# EAGLE board NGDash (EAGLE 9.2.1), part 1 of 2
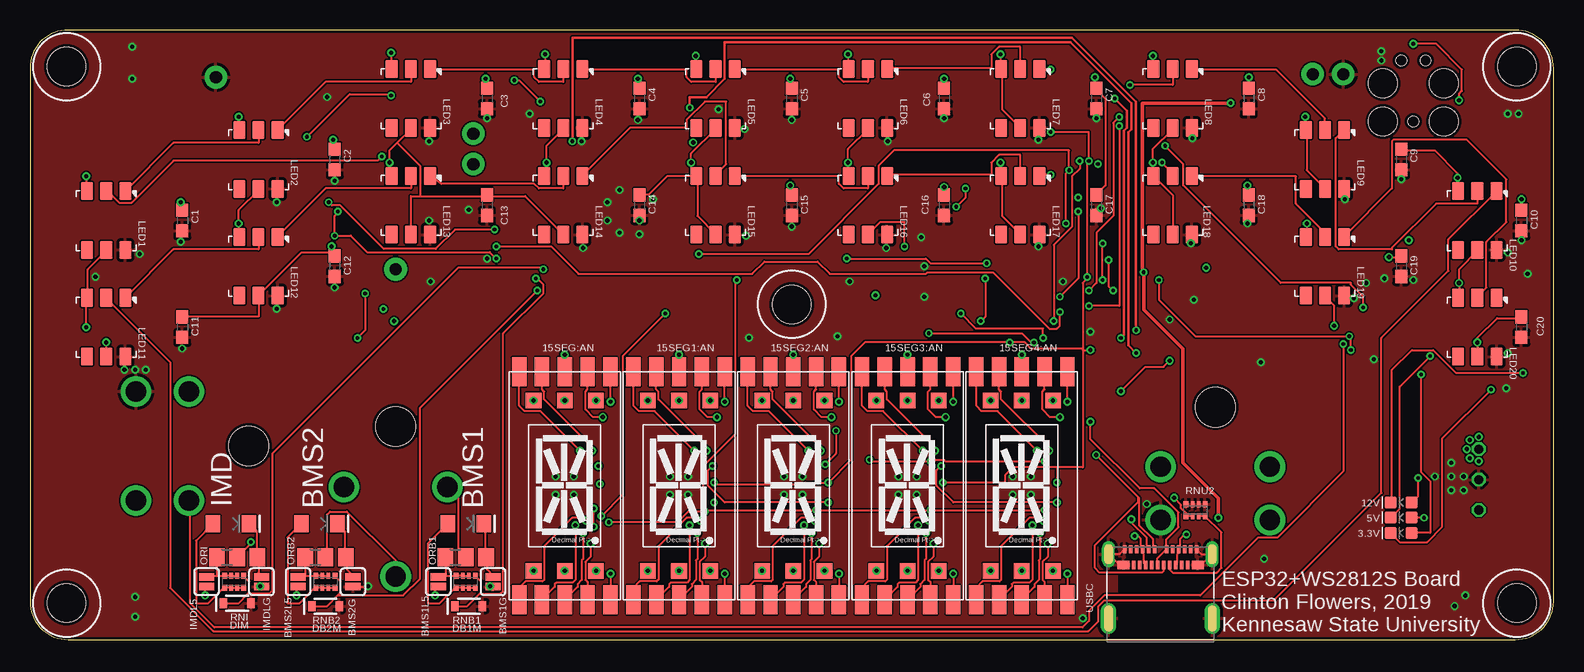
[diagram p5: board, top side]
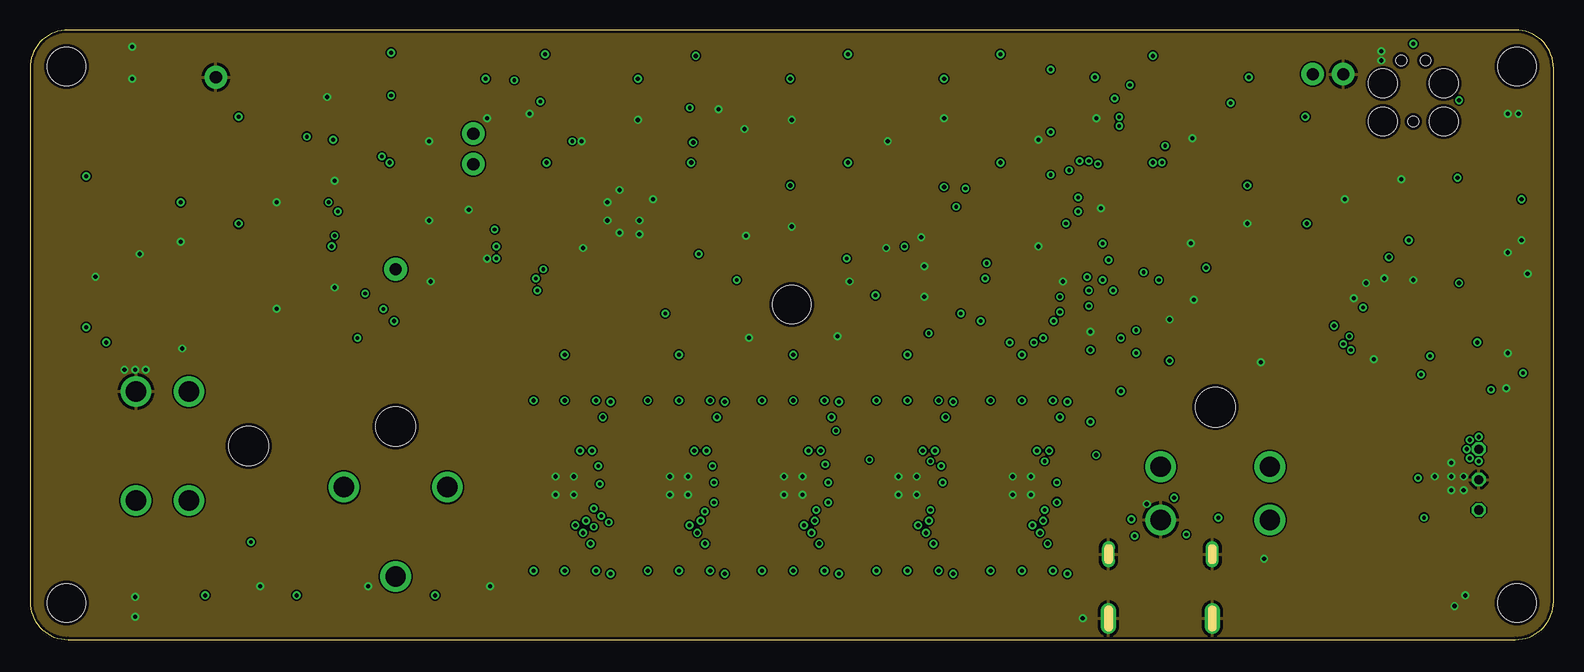
[diagram p6: board, inner layer Route2]
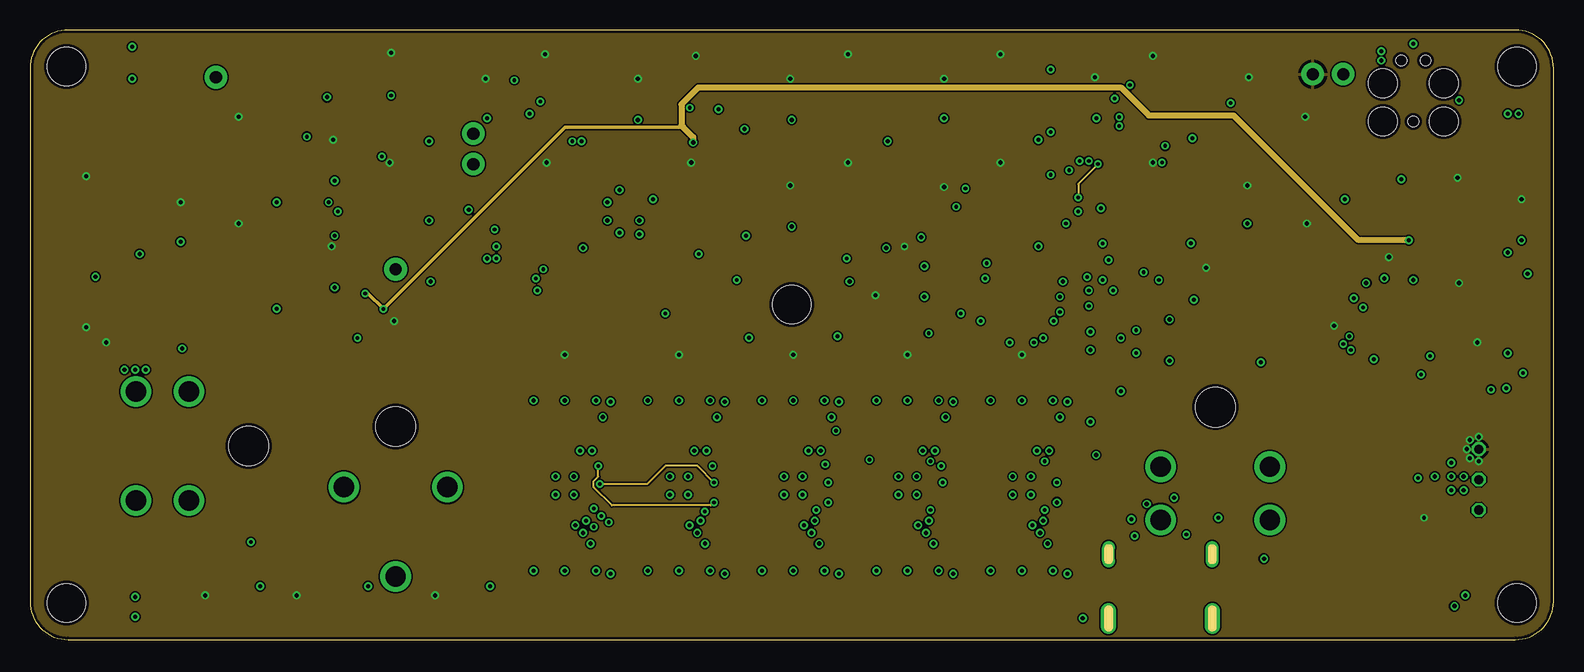
[diagram p7: board, inner layer Route15]
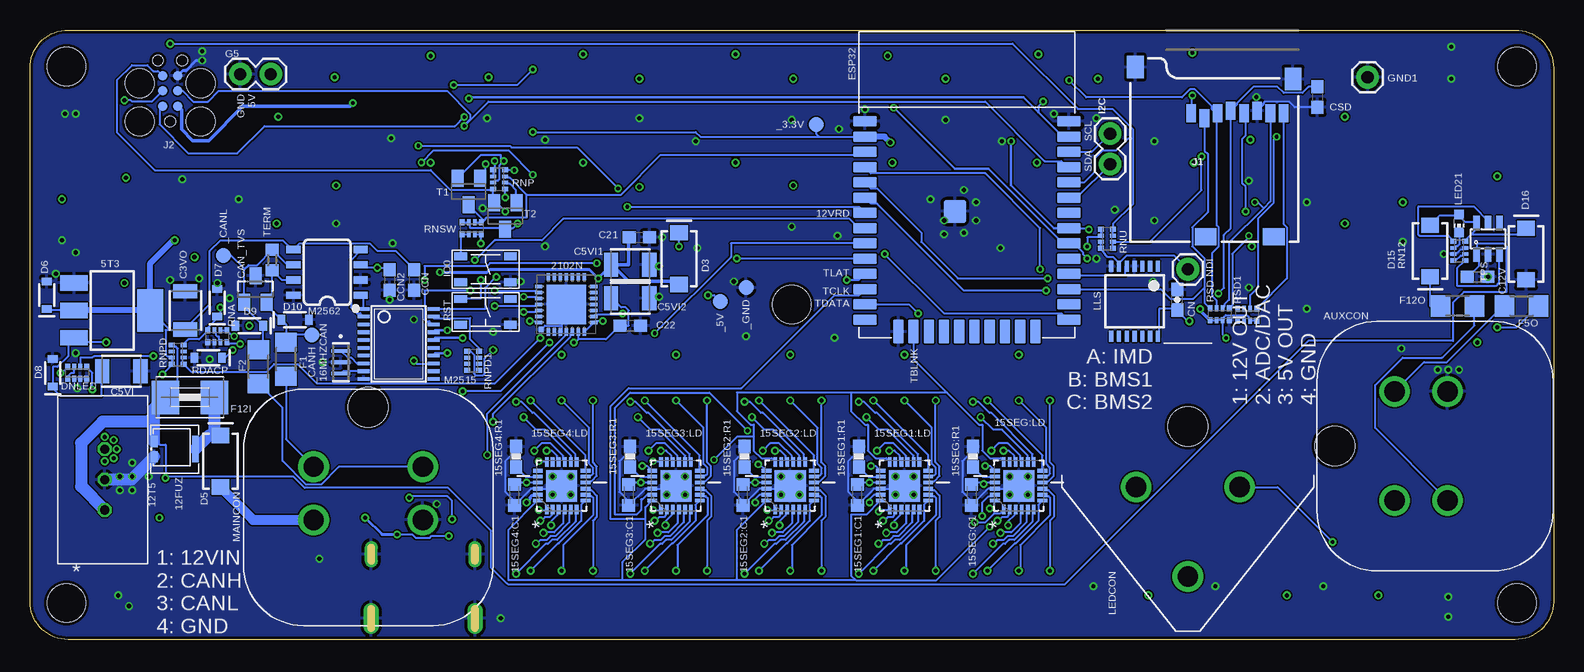
[diagram p8: board, bottom side, seen from below]

Size 127 x 50.8 mm. Coordinates in mm from the lower left corner, seen from the top.
Outline: 0,47.62 0,3.17 arc90 3.17,0 123.83,0 arc90 127,3.17 127,47.62 arc90 123.83,50.8 3.17,50.8 arc90 0,47.62
Copper layers (1*2*15*16): Top 0.035mm / dielectric 0.23mm / Route2 0.035mm / dielectric 0.93mm / Route15 0.035mm / dielectric 0.23mm / Bottom 0.035mm
Design rules "MF_Standard_4_Layer": minimum track width 5mil, minimum drill 12mil, track to track 5mil, track to pad 5mil, pad to pad 5mil, via to via 5mil, smd to smd 0mil, copper to edge 10mil, drill to drill 10mil, minimum pad ring 6mil, minimum via ring 6mil, stop-mask expansion 2mil, vias tented up to drill 25mil, thermal gap 10mil
Net classes: 0 default: width 0.152 mm; 1 alphanumeric: width 0.127 mm; 5 8mil: width 0.203 mm, drill 0.305 mm, clearance 0.064 mm
Holes 3.2 mm at 123.95,3.05 3.05,3.05 123.95,47.75 3.05,47.75 63.5,27.94
Milling: 4 lines

## Footprints (pad centres in the part's own frame; a part is rotated, then mirrored left to right if it is on the bottom)
LED-0603 = smd 1 x 1: A -0.877,0; C 0.877,0
SOT-223 = smd 1.27 x 2.286: 1 -2.286,-3.175; 2 0,-3.175; 3 2.286,-3.175 | smd 3.556 x 2.159: TER 0,3.175
LITTELFUSE-POLYZEN-ZEN164V130A24LS = smd 0.56 x 2.21: P1VIN -1.72,0 | smd 0.56 x 0.94: P2GND 1.72,0.635; P3VOUT 1.72,-0.635
TRACO-TSR-2-2450 = drill 0.76 octagon: 1VIN -2.54,0; 2GND 0,0; 3VOUT 2.54,0
ACPSA04-41SYKWA = smd 1.2 x 2.4: P$1 -3.8,-9.5; P$2 -1.9,-9.5; P$3 0,-9.5; P$4 1.9,-9.5; P$5 3.8,-9.5; P$12 3.8,9.5; P$13 1.9,9.5; P$14 0,9.5; P$15 -1.9,9.5; P$16 -3.8,9.5 | smd 1.3 x 1.3: P$6 2.6,-7.1; P$7 0,-7.1; P$8 -2.6,-7.1; P$9 -2.6,7.1; P$10 0,7.1; P$11 2.6,7.1
C0603K = smd 1.05 x 1.08: 1 -0.875,0; 2 0.875,0
QFN50P400X400X100-25N = smd 0.813 x 0.305: 1 -1.981,1.245; 2 -1.981,0.762; 3 -1.981,0.254; 4 -1.981,-0.254; 5 -1.981,-0.762; 6 -1.981,-1.245; 13 1.981,-1.245; 14 1.981,-0.762; 15 1.981,-0.254; 16 1.981,0.254; 17 1.981,0.762; 18 1.981,1.245 | smd 0.305 x 0.813: 7 -1.245,-1.981; 8 -0.762,-1.981; 9 -0.254,-1.981; 10 0.254,-1.981; 11 0.762,-1.981; 12 1.245,-1.981; 19 1.245,1.981; 20 0.762,1.981; 21 0.254,1.981; 22 -0.254,1.981; 23 -0.762,1.981; 24 -1.245,1.981 | smd 2.591 x 2.591: 25 -0.025,0
0603-RES = smd 1.1 x 1: 1 -0.85,0; 2 0.85,0
OSC_CSTCE16M0V53-R0 = smd 0.3 x 1.6: 1 -0.95,0; 2 0,0; 3 0.95,0
MLP28 = smd 0.6 x 0.3: 1 -2.3,1.5; 2 -2.3,1; 3 -2.3,0.5; 4 -2.3,0; 5 -2.3,-0.5; 6 -2.3,-1; 7 -2.3,-1.5; 15 2.3,-1.5; 16 2.3,-1; 17 2.3,-0.5; 18 2.3,0; 19 2.3,0.5; 20 2.3,1; 21 2.3,1.5 | smd 0.3 x 0.6: 8 -1.5,-2.3; 9 -1,-2.3; 10 -0.5,-2.3; 11 0,-2.3; 12 0.5,-2.3; 13 1,-2.3; 14 1.5,-2.3; 22 1.5,2.3; 23 1,2.3; 24 0.5,2.3; 25 0,2.3; 26 -0.5,2.3; 27 -1,2.3; 28 -1.5,2.3 | smd 3.3 x 3.3: EXP 0,0 | smd 0.435 x 0.435: M -2.103,2.103
TP = smd 1.25 x 1.25: P$1 0,0
AMP-AT04-4P-BM02 = drill 1.7: 1 -4.55,-2.21; 2 -4.55,2.21; 3 4.55,2.21; 4 4.55,-2.21 | hole 3.3: 0,7.18
LED-1206 = smd 1.2 x 1.4: A -1.5,0; C 1.5,0
SMT-JUMPER_2_NO_SILK = smd 0.635 x 1.27: 1 -0.406,0; 2 0.406,0
C0603 = smd 1.1 x 1: 1 -0.85,0; 2 0.85,0
1210 = smd 1.2 x 2: 1 -1.6,0; 2 1.6,0
SOT23 = smd 1 x 1.4: 1 -0.95,-1.1; 2 0.95,-1.1; 3 0,1.1
0603-CAP = smd 1.1 x 1: 1 -0.85,0; 2 0.85,0
SMA-DIODE = smd 1.27 x 1.47: A -2.15,0; C 2.15,0
SOD-323 = smd 0.63 x 0.83: A 1.15,0; C -1.15,0
4X0402ARV341 = smd 0.4 x 0.5: 1 -0.8,-0.5; 4 0.8,-0.5; 5 0.8,0.5; 8 -0.8,0.5 | smd 0.3 x 0.5: 2 -0.25,-0.5; 3 0.25,-0.5; 6 0.25,0.5; 7 -0.25,0.5
ESP32-WROOM32 = smd 2 x 0.9: 1 0,16.51; 2 0,15.24; 3 0,13.97; 4 0,12.7; 5 0,11.43; 6 0,10.16; 7 0,8.89; 8 0,7.62; 9 0,6.35; 10 0,5.08; 11 0,3.81; 12 0,2.54; 13 0,1.27; 14 0,0; 25 17,0; 26 17,1.27; 27 17,2.54; 28 17,3.81; 29 17,5.08; 30 17,6.35; 31 17,7.62; 32 17,8.89; 33 17,10.16; 34 17,11.43; 35 17,12.7; 36 17,13.97; 37 17,15.24; 38 17,16.51 | smd 0.9 x 2: 15 2.785,-1; 16 4.055,-1; 17 5.325,-1; 18 6.595,-1; 19 7.865,-1; 20 9.135,-1; 21 10.405,-1; 22 11.675,-1; 23 12.945,-1; 24 14.215,-1 | smd 1.905 x 1.905: GND 7.5,9.01
R1206 = smd 1.6 x 1.803: 1 -1.422,0; 2 1.422,0
1812 = smd 2.286 x 2.794: 1 -2.046,0; 2 2.046,0
1X02 = drill 1.016 pad 1.88: 1 0,0; 2 2.54,0
1X01 = drill 1.016 pad 1.88: 1 0,0
TACT4.2MM = smd 1.05 x 0.65: P$1 -2.075,1.075; P$2 2.075,1.075; P$3 -2.075,-1.075; P$4 2.075,-1.075
MICRO-SD-SOCKET = smd 1.8 x 1.4: CD1 -2.05,0.4; CD2 -7.75,0.4 | smd 0.8 x 1.5: CS -7.84,10.3; DI -6.74,10.7; DO -2.34,10.7; GND -3.44,10.9; RSV1 -8.94,10.7; RSV2 -1.24,10.7; SCLK -4.54,10.7; VCC -5.64,10.9 | smd 1.4 x 1.9: GND1 -13.6,14.55; GND3 -0.45,13.55
TC2030-MCP = smd 0.787 x 0.787: 1 1.27,-0.635; 2 1.27,0.635; 3 2.54,-0.635; 4 2.54,0.635; 5 3.81,-0.635; 6 3.81,0.635 | hole 0.889: 0,0; 5.08,-1.016; 5.08,1.016 | hole 2.375: 0,2.54; 0,-2.54; 3.175,-2.54; 3.175,2.54
WS2812S5050 = smd 1.5 x 1: 1_FS_DO 2.45,-1.6; 2_FS_DI 2.45,0; 3_FS_VCC 2.45,1.6; 4_FS -2.45,1.6; 5_FS_5V -2.45,0; 6_FS_GND -2.45,-1.6
CHIP-LED0603 = smd 0.8 x 0.8: A 0,-0.75; C 0,0.75
AMP-AT04-3P-BM02 = drill 1.7: A 4.3,0; B -4.3,0; C 0,-7.45 | hole 3.3: 0,5.05
TSSOP14 = smd 0.35 x 0.9: 1 -1.95,-2.925; 2 -1.3,-2.925; 3 -0.65,-2.925; 4 0,-2.925; 5 0.65,-2.925; 6 1.3,-2.925; 7 1.95,-2.925; 8 1.95,2.925; 9 1.3,2.925; 10 0.65,2.925; 11 0,2.925; 12 -0.65,2.925; 13 -1.3,2.925; 14 -1.95,2.925
TSSOP20 = smd 0.305 x 0.991: 1 -2.925,-2.918; 2 -2.275,-2.918; 3 -1.625,-2.918; 4 -0.975,-2.918; 5 -0.325,-2.918; 6 0.325,-2.918; 7 0.975,-2.918; 8 1.625,-2.918; 9 2.275,-2.918; 10 2.925,-2.918; 11 2.925,2.918; 12 2.275,2.918; 13 1.625,2.918; 14 0.975,2.918; 15 0.325,2.918; 16 -0.325,2.918; 17 -0.975,2.918; 18 -1.625,2.918; 19 -2.275,2.918; 20 -2.925,2.918
SO08 = smd 0.6 x 1.2: 1 -1.905,-2.8; 2 -0.635,-2.8; 3 0.635,-2.8; 4 1.905,-2.8; 5 1.905,2.8; 6 0.635,2.8; 7 -0.635,2.8; 8 -1.905,2.8
A0R-JMP = smd 1.5 x 1.3: 1 0,1.7; 2 0,0; 3 0,-1.7
SOT23-BEC = smd 1 x 1.4: B -0.95,-1.1; C 0,1.1; E 0.95,-1.1
R0603 = smd 1 x 1.1: 1 -0.85,0; 2 0.85,0
SOT23-6 = smd 0.55 x 1.2: 1 -0.95,-1.3; 2 0,-1.3; 3 0.95,-1.3; 4 0.95,1.3; 5 0,1.3; 6 -0.95,1.3
MOLEX_105450-0101 = smd 0.3 x 0.7: A1 -3,3.77; A2 -2.5,3.77; A3 -2,3.77; A4 -1.5,3.77; A5 -1,3.77; A6 -0.5,3.77; A7 0.5,3.77; A8 1,3.77; A9 1.5,3.77; A10 2,3.77; A11 2.5,3.77; A12 3,3.77; B2 2.25,2.47; B3 1.75,2.47; B4 1.25,2.47; B5 0.75,2.47; B6 0.25,2.47; B7 -0.25,2.47; B8 -0.75,2.47; B9 -1.25,2.47; B10 -1.75,2.47; B11 -2.25,2.47 | smd 1 x 0.7: B1 3.1,2.47; B12 -3.1,2.47 | drill 0.6 pad 1.1 long: S1 -4.32,3.36; S2 4.32,3.36 | drill 0.6 pad 1.3 long: S3 -4.32,-2; S4 4.32,-2

## Placement (x,y rotation side)
3.3V  BLUE  [LED-0603]  114.3,8.89 180 top
5T3  CJT1117-3.3-SOT223  [SOT-223]  120.14,27.43 270 bottom
5V  BLUE  [LED-0603]  114.3,10.16 180 top
12FUZ  LITTELFUSE-POLYZEN-ZEN164V130A24LS  [LITTELFUSE-POLYZEN-ZEN164V130A24LS]  114.94,15.88 180 bottom
12T5  TRACO-TSR-2-2450  [TRACO-TSR-2-2450]  120.78,13.34 90 bottom
12V  BLUE  [LED-0603]  114.3,11.43 180 top
15SEG1:AN  ACPSA04-41SYKWA  [ACPSA04-41SYKWA]  54.1,12.83 0 top
15SEG1:C1  0.1uF  [C0603K]  58.04,12.06 270 bottom
15SEG1:LD  TLC59281RGER  [QFN50P400X400X100-25N]  54.1,12.83 90 bottom
15SEG1:R1  2.5k  [0603-RES]  57.91,15.24 90 bottom
15SEG2:AN  ACPSA04-41SYKWA  [ACPSA04-41SYKWA]  63.63,12.83 0 top
15SEG2:C1  0.1uF  [C0603K]  67.56,12.06 270 bottom
15SEG2:LD  TLC59281RGER  [QFN50P400X400X100-25N]  63.63,12.83 90 bottom
15SEG2:R1  2.5k  [0603-RES]  67.44,15.24 90 bottom
15SEG3:AN  ACPSA04-41SYKWA  [ACPSA04-41SYKWA]  73.15,12.83 0 top
15SEG3:C1  0.1uF  [C0603K]  77.09,12.06 270 bottom
15SEG3:LD  TLC59281RGER  [QFN50P400X400X100-25N]  73.15,12.83 90 bottom
15SEG3:R1  2.5k  [0603-RES]  76.96,15.24 90 bottom
15SEG4:AN  ACPSA04-41SYKWA  [ACPSA04-41SYKWA]  82.68,12.83 0 top
15SEG4:C1  0.1uF  [C0603K]  86.61,12.06 270 bottom
15SEG4:LD  TLC59281RGER  [QFN50P400X400X100-25N]  82.68,12.83 90 bottom
15SEG4:R1  2.5k  [0603-RES]  86.49,15.24 90 bottom
15SEG:AN  ACPSA04-41SYKWA  [ACPSA04-41SYKWA]  44.58,12.83 0 top
15SEG:C1  0.1uF  [C0603K]  48.51,12.06 270 bottom
15SEG:LD  TLC59281RGER  [QFN50P400X400X100-25N]  44.58,12.83 90 bottom
15SEG:R1  2.5k  [0603-RES]  48.39,15.24 90 bottom
16MHZCAN  CSTCE16M0VH3L99-R0  [OSC_CSTCE16M0V53-R0]  101.09,23.11 270 bottom
2102N  CP2102N-A01-GQFN28R  [MLP28]  82.3,27.94 90 bottom
_3.3V  TP  [TP]  61.47,42.93 180 bottom
_5V  TP  [TP]  69.47,28.19 270 bottom
_CANH  TP  [TP]  103.5,25.4 270 bottom
_CANL  TP  [TP]  110.87,32 90 bottom
_GND  TP  [TP]  67.31,29.34 270 bottom
AUXCON  AMP-AT04-4P-BM02-DEUTSCH  [AMP-AT04-4P-BM02]  11.05,16.13 90 bottom
BMS1  [LED-1206]  36.32,9.65 0 top
BMS1G  JUMPER-SMT_2_NO_SILK  [SMT-JUMPER_2_NO_SILK]  38.61,4.83 90 top
BMS1L5  JUMPER-SMT_2_NO_SILK  [SMT-JUMPER_2_NO_SILK]  34.04,4.83 90 top
BMS2  [LED-1206]  24.13,9.65 0 top
BMS2G  JUMPER-SMT_2_NO_SILK  [SMT-JUMPER_2_NO_SILK]  26.92,4.83 90 top
BMS2L5  JUMPER-SMT_2_NO_SILK  [SMT-JUMPER_2_NO_SILK]  22.35,4.83 90 top
C1  0.1uF  [C0603]  12.7,34.92 270 top
C2  0.1uF  [C0603]  25.4,40.01 270 top
C3  0.1uF  [C0603]  38.1,45.09 270 top
C3VO  10uF  [1210]  114.05,27.43 90 bottom
C4  0.1uF  [C0603]  50.8,45.09 270 top
C5  0.1uF  [C0603]  63.5,45.09 270 top
C5VI  10uF  [1210]  119.38,22.35 0 bottom
C5VI1  10uF  [1210]  76.96,31.24 0 bottom
C5VI2  10uF  [1210]  76.96,28.45 0 bottom
C6  0.1uF  [C0603]  76.2,45.09 270 top
C7  0.1uF  [C0603]  88.9,45.09 270 top
C8  0.1uF  [C0603]  101.6,45.09 270 top
C9  0.1uF  [C0603]  114.3,40.01 270 top
C10  0.1uF  [C0603]  124.33,34.92 270 top
C11  0.1uF  [C0603]  12.7,26.04 270 top
C12  0.1uF  [C0603]  25.4,31.11 270 top
C12V  [C0603]  6.35,30.23 0 bottom
C13  0.1uF  [C0603]  38.1,36.2 270 top
C14  0.1uF  [C0603]  50.8,36.2 270 top
C15  0.1uF  [C0603]  63.5,36.2 270 top
C16  0.1uF  [C0603]  76.2,36.2 270 top
C17  0.1uF  [C0603]  88.9,36.2 270 top
C18  0.1uF  [C0603]  101.6,36.2 270 top
C19  0.1uF  [C0603]  114.3,31.11 270 top
C20  0.1uF  [C0603]  124.33,26.04 270 top
C21  0.1uF  [C0603]  76.2,33.53 0 bottom
C22  0.1uF  [C0603]  76.96,26.16 0 bottom
CAN_TVS  PESD1CAN,215  [SOT23]  108.2,29.21 0 bottom
CCN  0.1uF  [C0603]  95,29.97 270 bottom
CCN2  0.1uF  [C0603]  97.03,29.97 270 bottom
CN  0.1uF  [0603-CAP]  31.37,28.32 90 bottom
CSD  0.1uF  [C0603]  19.68,45.21 270 bottom
D3  3A/40V/500mV  [SMA-DIODE]  72.9,31.75 90 bottom
D5  3A/40V/500mV  [SMA-DIODE]  111.12,14.86 90 bottom
D6  3.3V  [SOD-323]  125.6,28.7 90 bottom
D7  3.3V  [SOD-323]  111.38,28.07 90 bottom
D8  5.6V  [SOD-323]  125.09,22.23 90 bottom
D9  5.6V  [SOD-323]  108.71,26.16 180 bottom
D10  5.6V  [SOD-323]  104.9,26.67 0 bottom
D15  3A/40V/500mV  [SMA-DIODE]  10.29,32.38 270 bottom
D16  3A/40V/500mV  [SMA-DIODE]  2.29,32.13 90 bottom
DB1M  3.3V  [SOD-323]  36.58,2.79 0 top
DB2M  3.3V  [SOD-323]  24.64,2.79 0 top
DIM  3.3V  [SOD-323]  17.27,3.05 0 top
DNLED  1k  [4X0402ARV341]  123.06,22.23 0 bottom
ESP32  ESP32-WROOM-32  [ESP32-WROOM32]  57.4,26.67 0 bottom
F1  [R1206]  105.66,23.37 270 bottom
F2  [R1206]  107.95,22.73 270 bottom
F5O  [R1206]  2.67,27.81 180 bottom
F12I  [1812]  113.67,20.19 180 bottom
F12O  [R1206]  8,27.81 0 bottom
G5  [1X02]  109.47,47.12 0 bottom
GND1  [1X01]  15.49,46.86 0 bottom
I2C  [1X02]  36.96,39.62 90 bottom
IMD  [LED-1206]  16.76,9.65 0 top
IMDL5  JUMPER-SMT_2_NO_SILK  [SMT-JUMPER_2_NO_SILK]  14.73,4.83 90 top
IMDLG  JUMPER-SMT_2_NO_SILK  [SMT-JUMPER_2_NO_SILK]  19.3,4.83 90 top
IO0  MF-SW-TACT-4.2MM  [TACT4.2MM]  89.03,30.86 180 bottom
J1  MICRO-SD_CARD_SOCKET  [MICRO-SD-SOCKET]  21.26,33.16 0 bottom
J2  [TC2030-MCP]  115.32,43.18 90 bottom
LED1  WS2812S  [WS2812S5050]  6.35,34.92 90 top
LED2  WS2812S  [WS2812S5050]  19.05,40.01 90 top
LED3  WS2812S  [WS2812S5050]  31.75,45.09 90 top
LED4  WS2812S  [WS2812S5050]  44.45,45.09 90 top
LED5  WS2812S  [WS2812S5050]  57.15,45.09 90 top
LED6  WS2812S  [WS2812S5050]  69.85,45.09 90 top
LED7  WS2812S  [WS2812S5050]  82.55,45.09 90 top
LED8  WS2812S  [WS2812S5050]  95.25,45.09 90 top
LED9  WS2812S  [WS2812S5050]  107.95,40.01 90 top
LED10  WS2812S  [WS2812S5050]  120.65,34.92 90 top
LED11  WS2812S  [WS2812S5050]  6.35,26.04 90 top
LED12  WS2812S  [WS2812S5050]  19.05,31.11 90 top
LED13  WS2812S  [WS2812S5050]  31.75,36.2 90 top
LED14  WS2812S  [WS2812S5050]  44.45,36.2 90 top
LED15  WS2812S  [WS2812S5050]  57.15,36.2 90 top
LED16  WS2812S  [WS2812S5050]  69.85,36.2 90 top
LED17  WS2812S  [WS2812S5050]  82.55,36.2 90 top
LED18  WS2812S  [WS2812S5050]  95.25,36.2 90 top
LED19  WS2812S  [WS2812S5050]  107.95,31.11 90 top
LED20  WS2812S  [WS2812S5050]  120.65,26.04 90 top
LED21  [CHIP-LED0603]  7.87,34.67 180 bottom
LEDCON  AMP-AT04-3P-BM02-DEUTSCH  [AMP-AT04-3P-BM02]  30.48,12.7 0 bottom
LLS  74ABT125PW  [TSSOP14]  34.92,28.19 180 bottom
M2515  MCP2515-E/ST  [TSSOP20]  96.27,24.64 270 bottom
M2562  MCP2551  [SO08]  102.23,30.61 90 bottom
MAINCON  AMP-AT04-4P-BM02-DEUTSCH  [AMP-AT04-4P-BM02]  98.81,12.19 0 bottom
NDI  [1X01]  30.48,30.86 180 bottom
ORB1  0R-JUMPA  [A0R-JMP]  36.32,6.86 90 top
ORB2  0R-JUMPA  [A0R-JMP]  24.64,6.86 90 top
ORI  0R-JUMPA  [A0R-JMP]  17.27,6.86 90 top
RDACP  3.3V  [SOD-323]  112.14,23.5 180 bottom
RN12  1k  [4X0402ARV341]  7.87,32.38 90 bottom
RNA  1k  [4X0402ARV341]  111.38,25.27 0 bottom
RNB1  1k  [4X0402ARV341]  36.32,4.83 180 top
RNB2  1k  [4X0402ARV341]  24.64,4.83 180 top
RNI  1k  [4X0402ARV341]  17.02,4.83 180 top
RNP  10k  [4X0402ARV341]  87.88,38.35 270 bottom
RNPD  10k  [4X0402ARV341]  114.68,23.75 270 bottom
RNPD1  10k  [4X0402ARV341]  90.04,23.24 270 bottom
RNSW  1k  [4X0402ARV341]  90.17,34.29 0 bottom
RNU  1k  [4X0402ARV341]  37.21,33.4 270 bottom
RNU2  10k  [4X0402ARV341]  97.16,10.79 0 top
RSD  50k  [4X0402ARV341]  27.83,27.09 180 bottom
RSD1  50k  [4X0402ARV341]  25.54,27.07 180 bottom
RST  MF-SW-TACT-4.2MM  [TACT4.2MM]  89.03,27.3 180 bottom
T1  [SOT23-BEC]  90.42,37.34 180 bottom
T2  [SOT23-BEC]  87.38,35.31 180 bottom
TERM  120  [R0603]  106.81,31.62 270 bottom
TPS  TI-TPS22810-Q1  [SOT23-6]  5.46,33.4 0 bottom
USBC  105450-0101  [MOLEX_105450-0101]  94.23,3.76 0 top